# EAGLE design eagle_mini (EAGLE 7.2.0)
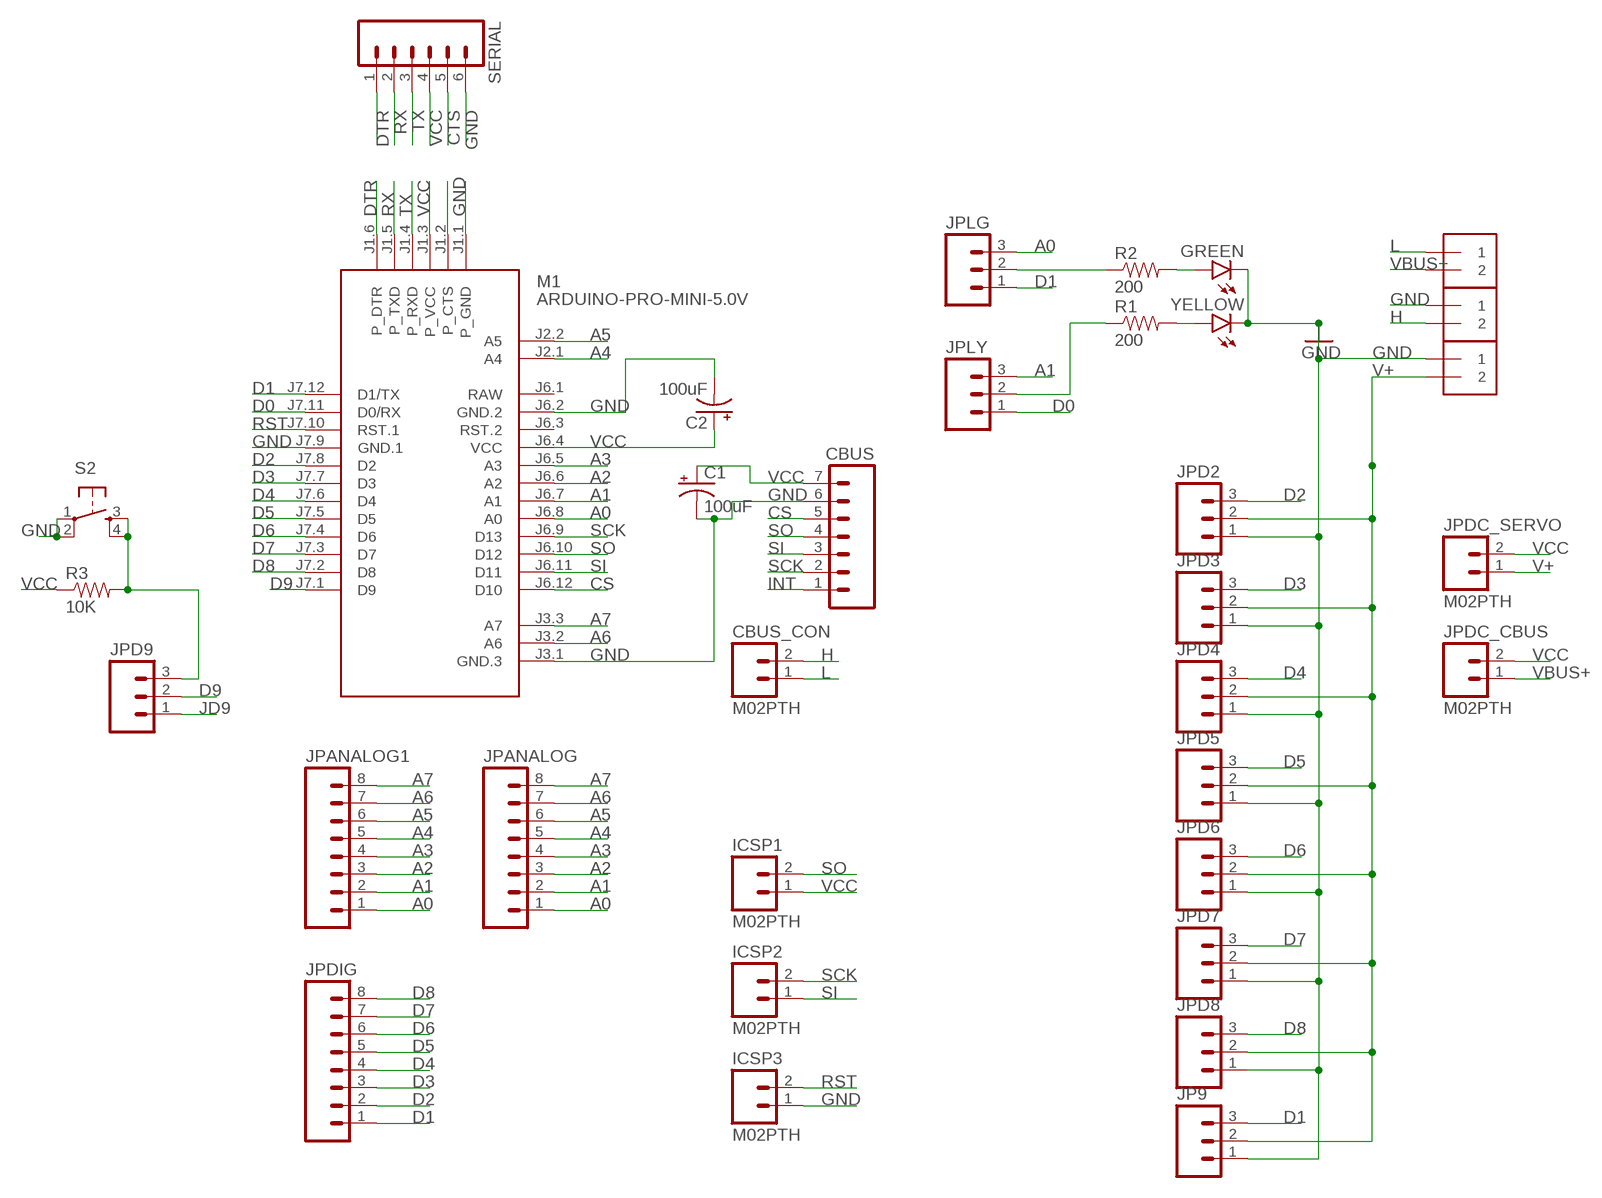
[diagram p0: schematic, sheet 1]

## Parts
C1  100uF  CPOL-USE2.5-6  [E2,5-6]
C2  100uF  CPOL-USE2.5-6  [E2,5-6]
CBUS  M07  [1X07]
CBUS_CON  M02PTH  [1X02]
EXT_VCC  1X2-3.5MM  [1X2-3.5MM]
GREEN  LED-3MM-NO_SILK  [LED3MM-NS]
ICSP1  M02PTH  [1X02]
ICSP2  M02PTH  [1X02]
ICSP3  M02PTH  [1X02]
J1  1X2-3.5MM  [1X2-3.5MM]
J2  1X2-3.5MM  [1X2-3.5MM]
JP9  M03PTH  [1X03]
JPANALOG  M08  [1X08_ROUND]
JPANALOG1  M08  [1X08_ROUND]
JPD2  M03PTH  [1X03]
JPD3  M03PTH  [1X03]
JPD4  M03PTH  [1X03]
JPD5  M03PTH  [1X03]
JPD6  M03PTH  [1X03]
JPD7  M03PTH  [1X03]
JPD8  M03PTH  [1X03]
JPD9  M03PTH  [1X03]
JPDC_CBUS  M02PTH  [1X02]
JPDC_SERVO  M02PTH  [1X02]
JPDIG  M08  [1X08_ROUND]
JPLG  M03PTH  [1X03]
JPLY  M03PTH  [1X03]
M1  ARDUINO-PRO-MINI-5.0V  [ARDUINO-PRO-MINI]
R1  200  RESISTORAXIAL-0.3  [AXIAL-0.3]
R2  200  RESISTORAXIAL-0.3  [AXIAL-0.3]
R3  10K  RESISTORAXIAL-0.3  [AXIAL-0.3]
S2  TAC_SWITCHPTH  [TACTILE-PTH]
SERIAL  M06SILK_FEMALE_PTH  [1X06]
YELLOW  LED-3MM-NO_SILK  [LED3MM-NS]

## Nets
A0: JPANALOG1.1 JPANALOG.1 JPLG.3 M1.J6.8(A0)
A1: JPANALOG1.2 JPANALOG.2 JPLY.3 M1.J6.7(A1)
A2: JPANALOG1.3 JPANALOG.3 M1.J6.6(A2)
A3: JPANALOG1.4 JPANALOG.4 M1.J6.5(A3)
A4: JPANALOG1.5 JPANALOG.5 M1.J2.1(A4)
A5: JPANALOG1.6 JPANALOG.6 M1.J2.2(A5)
A6: JPANALOG1.7 JPANALOG.7 M1.J3.2(A6)
A7: JPANALOG1.8 JPANALOG.8 M1.J3.3(A7)
CS: CBUS.5 M1.J6.12(D10)
CTS: SERIAL.5
D0: JPLY.1 M1.J7.11(D0/RX)
D1: JP9.3 JPDIG.1 JPLG.1 M1.J7.12(D1/TX)
D2: JPD2.3 JPDIG.2 M1.J7.8(D2)
D3: JPD3.3 JPDIG.3 M1.J7.7(D3)
D4: JPD4.3 JPDIG.4 M1.J7.6(D4)
D5: JPD5.3 JPDIG.5 M1.J7.5(D5)
D6: JPD6.3 JPDIG.6 M1.J7.4(D6)
D7: JPD7.3 JPDIG.7 M1.J7.3(D7)
D8: JPD8.3 JPDIG.8 M1.J7.2(D8)
D9: JPD9.2 M1.J7.1(D9)
DTR: M1.J1.6(P_DTR) SERIAL.1
GND: C1.- C2.- CBUS.6 EXT_VCC.1 GREEN.K(C) ICSP3.1 J1.1 JP9.1 JPD2.1 JPD3.1 JPD4.1 JPD5.1 JPD6.1 JPD7.1 JPD8.1 M1.J1.1(P_GND) M1.J3.1(GND.3) M1.J6.2(GND.2) M1.J7.9(GND.1) S2.1 S2.2 SERIAL.6 YELLOW.K(C)
H: CBUS_CON.2 J1.2
INT: CBUS.1
JD9: JPD9.1
L: CBUS_CON.1 J2.1
N$2: JPD9.3 R3.P$2 S2.3 S2.4
N$6: M1.J1.2(P_CTS)
N$17: GREEN.A R2.P$2
N$18: R1.P$2 YELLOW.A
N$27: JPLG.2 R2.P$1
N$28: JPLY.2 R1.P$1
RST: ICSP3.2 M1.J7.10(RST.1)
RX: M1.J1.5(P_TXD) SERIAL.2
SCK: CBUS.2 ICSP2.2 M1.J6.9(D13)
SI: CBUS.3 ICSP2.1 M1.J6.11(D11)
SO: CBUS.4 ICSP1.2 M1.J6.10(D12)
TX: M1.J1.4(P_RXD) SERIAL.3
V+: EXT_VCC.2 JP9.2 JPD2.2 JPD3.2 JPD4.2 JPD5.2 JPD6.2 JPD7.2 JPD8.2 JPDC_SERVO.1
VBUS+: J2.2 JPDC_CBUS.1
VCC: C1.+ C2.+ CBUS.7 ICSP1.1 JPDC_CBUS.2 JPDC_SERVO.2 M1.J1.3(P_VCC) M1.J6.4(VCC) R3.P$1 SERIAL.4
Unconnected: M1.J6.3(RST.2)

## Power pins joined to a net without a drawn wire
RAW: M1.J6.1(RAW)

## Library data of the parts
C1 C2 = adafruit:CPOL-US: POLARIZED CAPACITOR, American symbol
CBUS = SparkFun-Connectors:M07: Header 7 Standard 7-pin 0.1" header. Use with straight break away headers (SKU : PRT-00116), right angle break away headers (PRT-00553), swiss pins (PRT-00743), machine pins (PRT-00117), and female headers (PRT-00115). NOTES ON THE VARIANTS LOCK and LOCK_LONGPADS... This footprint was designed to help hold the alignment of a through-hole component (i.e. 7-pin header) while soldering it into place. You may notice that each hole has been shifted either up or down by 0.005 of an inch from it's more standard position (which is usually a perfectly straight line). This slight alteration caused the pins (the squares in the middle) to touch the edges of the holes. Because they are alternating, it causes a "brace" to hold the header in place. 0.005 has proven to be the perfect amount of "off-center" position when using our standard breakaway headers. Although looks a little odd when you look at the bare footprint, once you have a header in there, the alteration is very hard to notice. Also, if you push a header all the way into place, it is covered up entirely on the bottom side. This idea of altering the position of holes to aid alignment will be further integrated into the Sparkfun Library for other footprints. It can help hold any component with 3 or more connection pins.
CBUS_CON ICSP1-ICSP3 JPDC_CBUS JPDC_SERVO = SparkFun-Connectors:M02: Standard 2-pin 0.1" header. Use with - straight break away headers ( PRT-00116) - right angle break away headers (PRT-00553) - swiss pins (PRT-00743) - machine pins (PRT-00117) - female headers (PRT-00115) Molex polarized connector foot print use with: PRT-08233 with associated crimp pins and housings. 2.54_SCREWTERM for use with PRT-10571. 3.5mm Screw Terminal footprints for PRT-08084 5mm Screw Terminal footprints for use with PRT-08432
EXT_VCC J1 J2 = Arduino_merg:1X2: 3.5mm Terminal block http://www.ladyada.net/library/pcb/eaglelibrary.html
GREEN YELLOW = SparkFun-LED:LED: LEDs Standard schematic elements and footprints for 5mm, 3mm, 1206, and 0603 sized LEDs. 5mm - Spark Fun Electronics SKU : COM-00529 (and others)
JP9 JPD2-JPD9 JPLG JPLY = SparkFun-Connectors:M03: Header 3 Standard 3-pin 0.1" header. Use with straight break away headers (SKU : PRT-00116), right angle break away headers (PRT-00553), swiss pins (PRT-00743), machine pins (PRT-00117), and female headers (PRT-00115). Molex polarized connector foot print use with SKU : PRT-08232 with associated crimp pins and housings.
JPANALOG JPANALOG1 JPDIG = SparkFun-Connectors:M08: Header 8 Standard 8-pin 0.1" header. Use with straight break away headers (SKU : PRT-00116), right angle break away headers (PRT-00553), swiss pins (PRT-00743), machine pins (PRT-00117), and female headers (PRT-00115).
M1 = diy-modules:ARDUINO-PRO-MINI-*: Arduino Pro Mini
R1-R3 = SparkFun-Passives:RESISTOR: Resistor Basic schematic elements and footprints for 0603, 1206, and PTH resistors.
S2 = SparkFun-Retired:TAC_SWITCH: Momentary Switch Button commonly used for reset or general input. Spark Fun Electronics SKU : COM-00097 SMT- SWCH-08247
SERIAL = SparkFun-Connectors:M06: Header 6 Standard 6-pin 0.1" header. Use with straight break away headers (SKU : PRT-00116), right angle break away headers (PRT-00553), swiss pins (PRT-00743), machine pins (PRT-00117), and female headers (PRT-00115). Molex polarized connector foot print use with SKU : PRT-08094 with associated crimp pins and housings. NOTES ON THE VARIANTS LOCK and LOCK_LONGPADS... This footprint was designed to help hold the alignment of a through-hole component (i.e. 6-pin header) while soldering it into place. You may notice that each hole has been shifted either up or down by 0.005 of an inch from it's more standard position (which is a perfectly straight line). This slight alteration caused the pins (the squares in the middle) to touch the edges of the holes. Because they are alternating, it causes a "brace" to hold the component in place. 0.005 has proven to be the perfect amount of "off-center" position when using our standard breakaway headers. Although looks a little odd when you look at the bare footprint, once you have a header in there, the alteration is very hard to notice. Also,if you push a header all the way into place, it is covered up entirely on the bottom side. This idea of altering the position of holes to aid alignment will be further integrated into the Sparkfun Library for other footprints. It can help hold any component with 3 or more connection pins.; PROD_ID: CONN-08437

## Board
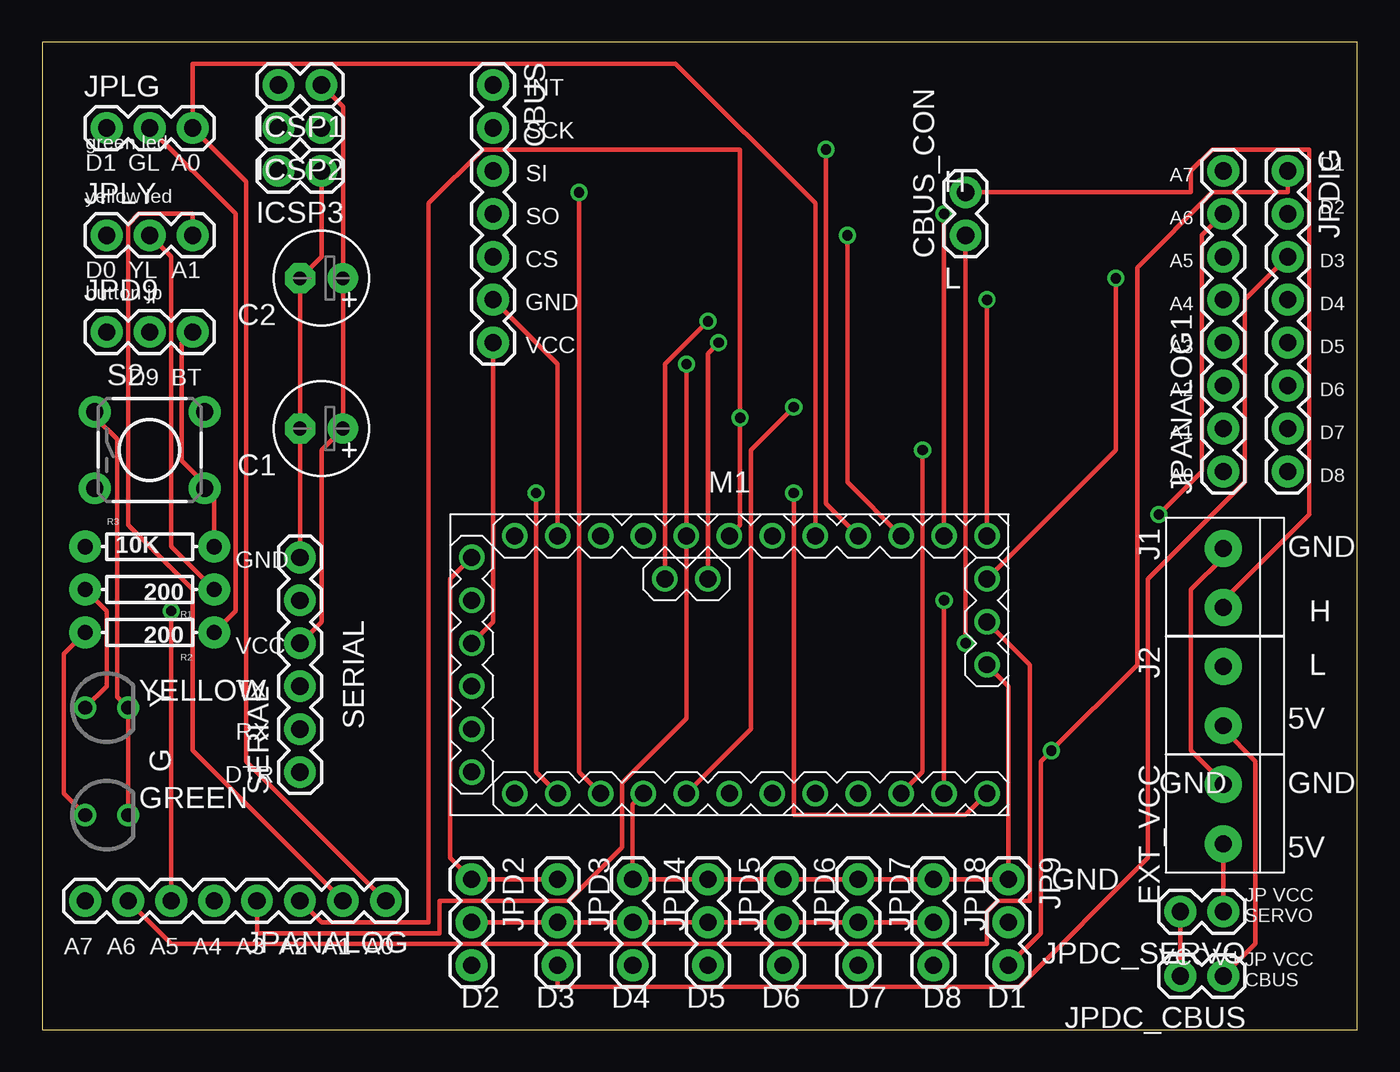
[diagram p1: board, top side]
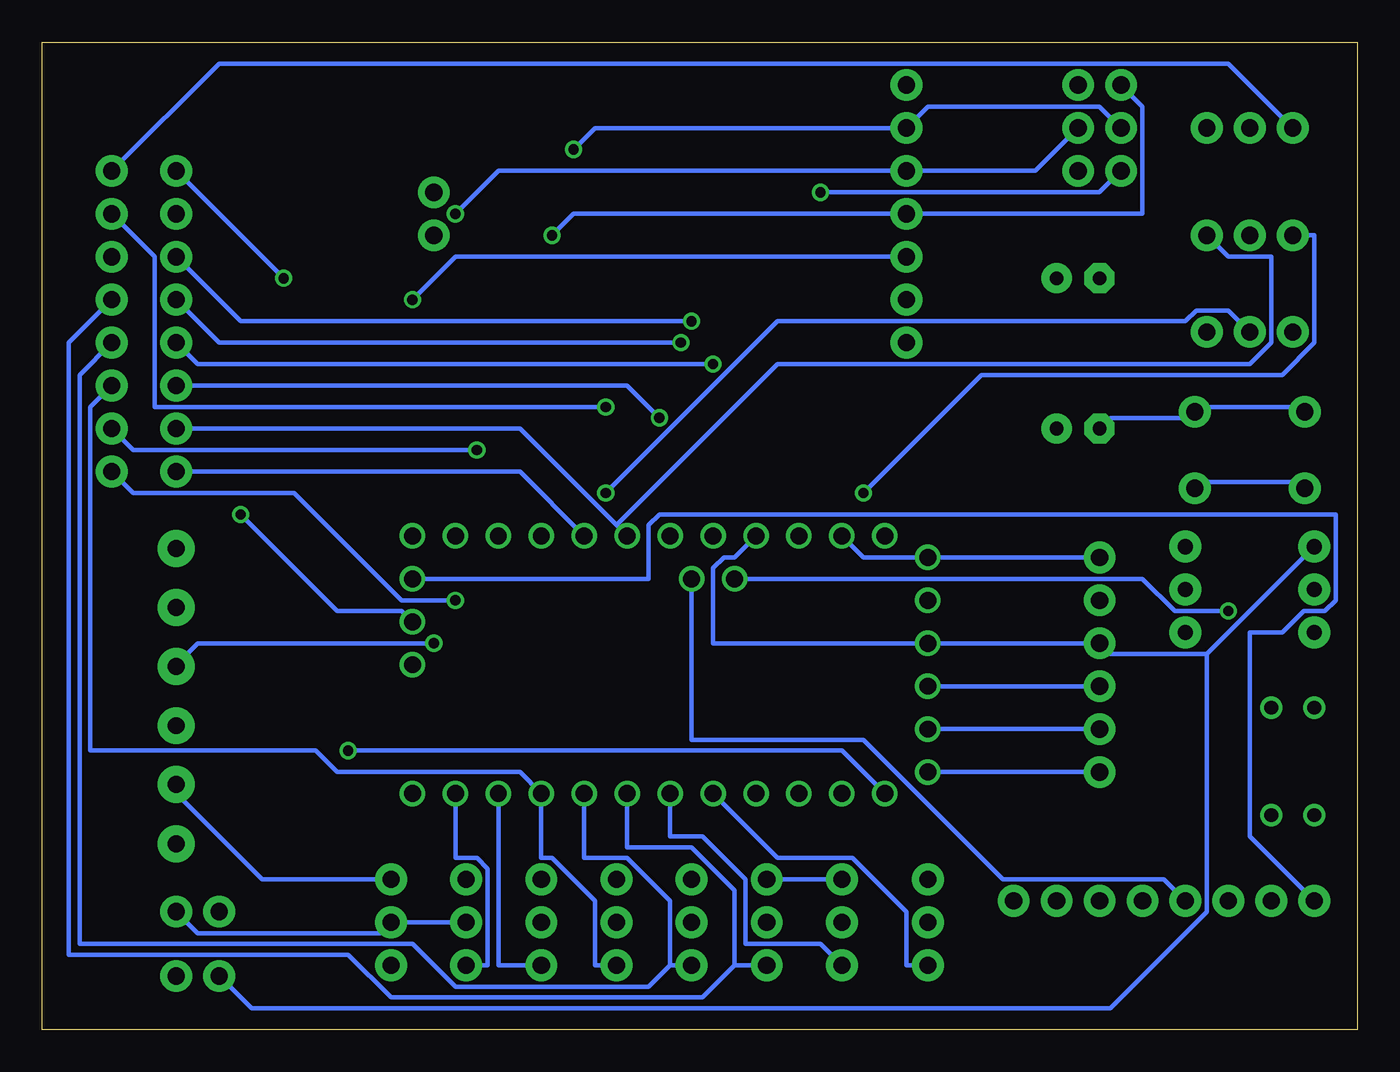
[diagram p2: board, bottom side, seen from below]

Size 77.78 x 58.41 mm. Coordinates in mm from the lower left corner, seen from the top.
Outline: 0,0 77.78,0 77.78,58.41 0,58.41 0,0
Copper layers (1*16): Top 0.035mm / dielectric 1.5mm / Bottom 0.035mm
Design rules "default": minimum track width 10mil, minimum drill 24mil, track to track 8mil, track to pad 8mil, pad to pad 8mil, via to via 8mil, smd to smd 8mil, copper to edge 40mil, drill to drill 8mil, minimum pad ring 10mil, minimum via ring 8mil, stop-mask expansion 4mil, vias tented up to drill 0mil, thermal gap 10mil

### Footprints (pad centres in the part's own frame; a part is rotated, then mirrored left to right if it is on the bottom)
E2,5-6 = drill 0.813 pad 1.778: + -1.27,0 | drill 0.813 pad 1.778 octagon: - 1.27,0
1X07 = drill 1.016 pad 1.88: 1 0,0; 2 2.54,0; 3 5.08,0; 4 7.62,0; 5 10.16,0; 6 12.7,0; 7 15.24,0
1X02 = drill 1.016 pad 1.88: 1 0,0; 2 2.54,0
1X2-3.5MM = drill 1 pad 2.184: 1 1.8,0; 2 -1.7,0
LED3MM-NS = drill 0.813: A -1.27,0; K 1.27,0
1X03 = drill 1.016 pad 1.88: 1 0,0; 2 2.54,0; 3 5.08,0
1X08_ROUND = drill 1.016 pad 1.88: 1 0,0; 2 2.54,0; 3 5.08,0; 4 7.62,0; 5 10.16,0; 6 12.7,0; 7 15.24,0; 8 17.78,0
ARDUINO-PRO-MINI = drill 1: J1.1 -15.24,6.35; J1.2 -15.24,3.81; J1.3 -15.24,1.27; J1.4 -15.24,-1.27; J1.5 -15.24,-3.81; J1.6 -15.24,-6.35; J2.1 -1.27,5.08; J2.2 -3.81,5.08; J3.1 15.24,0; J3.2 15.24,2.54; J3.3 15.24,5.08; J6.1 -12.7,7.62; J6.2 -10.16,7.62; J6.3 -7.62,7.62; J6.4 -5.08,7.62; J6.5 -2.54,7.62; J6.6 0,7.62; J6.7 2.54,7.62; J6.8 5.08,7.62; J6.9 7.62,7.62; J6.10 10.16,7.62; J6.11 12.7,7.62; J6.12 15.24,7.62; J7.1 15.24,-7.62; J7.2 12.7,-7.62; J7.3 10.16,-7.62; J7.4 7.62,-7.62; J7.5 5.08,-7.62; J7.6 2.54,-7.62; J7.7 0,-7.62; J7.8 -2.54,-7.62; J7.9 -5.08,-7.62; J7.10 -7.62,-7.62; J7.11 -10.16,-7.62; J7.12 -12.7,-7.62
AXIAL-0.3 = drill 0.9 pad 1.88: P$1 -3.81,0; P$2 3.81,0
TACTILE-PTH = drill 1.016 pad 1.88: 1 -3.251,2.261; 2 3.251,2.261; 3 -3.251,-2.261; 4 3.251,-2.261
1X06 = drill 1.016 pad 1.88: 1 0,0; 2 2.54,0; 3 5.08,0; 4 7.62,0; 5 10.16,0; 6 12.7,0

### Placement (x,y rotation side)
C1  16.51,35.56 180 top
C2  16.51,44.45 180 top
CBUS  26.67,55.88 270 top
CBUS_CON  54.61,46.99 90 top
EXT_VCC  69.85,12.7 90 top
GREEN  3.81,12.7 0 top
ICSP1  16.51,55.88 180 top
ICSP2  16.51,53.34 180 top
ICSP3  16.51,50.8 180 top
J1  69.85,26.67 90 top
J2  69.85,19.68 90 top
JP9  57.15,8.89 270 top
JPANALOG  20.32,7.62 180 top
JPANALOG1  69.85,33.02 90 top
JPD2  25.4,8.89 270 top
JPD3  30.48,8.89 270 top
JPD4  34.92,8.89 270 top
JPD5  39.37,8.89 270 top
JPD6  43.81,8.89 270 top
JPD7  48.26,8.89 270 top
JPD8  52.7,8.89 270 top
JPD9  3.81,41.27 0 top
JPDC_CBUS  69.85,3.17 180 top
JPDC_SERVO  69.85,6.99 180 top
JPDIG  73.66,50.8 270 top
JPLG  3.81,53.34 0 top
JPLY  3.81,46.99 0 top
M1  40.64,21.59 0 top
R1  6.35,26.04 180 top
R2  6.35,23.5 180 top
R3  6.35,28.57 0 top
S2  6.35,34.29 0 top
SERIAL  15.24,15.24 90 top
YELLOW  3.81,19.05 0 top

### Tracks (layer width: path | path; a pad name or v marks a point on that pad's centre or on a via)
A0
  Top 0.254: JPANALOG.1 12.06,15.88 12.06,50.16 JPLG.3 8.89,57.15 37.47,57.15 45.72,48.9 M1.J6.8
  Bottom 0.254: M1.J6.8 49.53,33.02 JPANALOG1.1
A1
  Top 0.254: JPANALOG.2 8.89,16.51 8.89,26.04 5.08,29.84 5.08,47.62 5.71,48.26 8.89,48.26 JPLY.3
  Bottom 0.254: 43.81,29.84 49.53,35.56 JPANALOG1.2 | 43.81,29.84 M1.J6.7 | 43.81,29.84 34.29,39.37 6.35,39.37 5.08,40.64 5.08,45.72 7.62,45.72 JPLY.3
A2  (via drill 0.61)
  Top 0.254: M1.J6.6 41.27,29.84 v41.27,36.2 41.27,52.07 26.04,52.07 22.86,48.9 22.86,6.35 16.51,6.35 JPANALOG.3
  Bottom 0.254: v41.27,36.2 43.18,38.1 JPANALOG1.3
A3  (via drill 0.61)
  Top 0.254: JPANALOG.4 12.7,5.71 23.5,5.71 23.5,7.62 31.11,7.62 34.29,10.79 34.29,14.61 38.1,18.41 M1.J6.5 v38.1,39.37
  Bottom 0.254: JPANALOG1.4 68.58,39.37 v38.1,39.37
A4  (via drill 0.61)
  Top 0.254: v40.01,40.64 39.37,40.01 M1.J2.1
  Bottom 0.254: M1.J2.1 39.37,17.14 29.21,17.14 20.95,8.89 11.43,8.89 JPANALOG.5 | JPANALOG1.5 67.31,40.64 v40.01,40.64
A5  (via drill 0.61)
  Top 0.254: JPANALOG.6 v7.62,24.77 | v39.37,41.91 36.83,39.37 M1.J2.2
  Bottom 0.254: M1.J2.2 12.7,26.67 10.79,24.77 v7.62,24.77 | JPANALOG1.6 66.04,41.91 v39.37,41.91
A6  (via drill 0.61)
  Top 0.254: v66.04,30.48 68.58,33.02 68.58,46.99 JPANALOG1.7 | JPANALOG.7 7.62,5.08 55.88,5.08 55.88,6.99 56.52,7.62 58.42,7.62 58.42,21.59 M1.J3.2
  Bottom 0.254: M1.J3.2 56.52,24.77 60.33,24.77 v66.04,30.48
A7  (via drill 0.61)
  Top 0.254: M1.J3.3 63.5,34.29 v63.5,44.45
  Bottom 0.254: JPANALOG1.8 v63.5,44.45 | JPANALOG.8 6.35,11.43 6.35,23.5 4.45,23.5 3.17,24.77 1.91,24.77 1.27,25.4 1.27,30.48 41.27,30.48 41.91,29.84 41.91,26.67 M1.J3.3
CS  (via drill 0.61)
  Top 0.254: v55.88,43.18 M1.J6.12
  Bottom 0.254: v55.88,43.18 53.34,45.72 CBUS.5
D0  (via drill 0.61)
  Top 0.254: M1.J7.11 29.21,15.24 v29.21,31.75
  Bottom 0.254: v29.21,31.75 22.23,38.73 4.45,38.73 2.54,40.64 2.54,46.99 JPLY.1
D1  (via drill 0.61)
  Top 0.254: JP9.3 59.05,5.71 59.05,15.88 v59.69,16.51 64.77,21.59 64.77,45.09 69.22,49.53 73.66,49.53 JPDIG.1
  Bottom 0.254: M1.J7.12 30.48,16.51 v59.69,16.51 | JPLG.1 7.62,57.15 67.31,57.15 JPDIG.1
D2  (via drill 0.61)
  Top 0.254: v44.45,36.83 41.91,34.29 41.91,17.78 M1.J7.8
  Bottom 0.254: M1.J7.8 34.29,10.16 29.84,10.16 26.67,6.99 26.67,3.81 JPD2.3 | JPDIG.2 71.12,45.72 71.12,36.83 v44.45,36.83
D3
  Top 0.254: JPDIG.3 71.12,43.18 71.12,32.38 65.41,26.67 65.41,10.16 57.78,2.54 30.48,2.54 JPD3.3
  Bottom 0.254: M1.J7.7 40.64,11.43 38.73,11.43 36.2,8.89 36.2,5.08 31.75,5.08 JPD3.3
D4
  Bottom 0.254: M1.J7.6 43.18,10.79 39.37,10.79 36.83,8.26 36.83,3.81 | JPD4.3 36.83,3.81 | JPDIG.4 76.2,40.64 76.2,4.45 59.69,4.45 57.15,1.91 38.73,1.91 36.83,3.81
D5
  Bottom 0.254: M1.J7.5 45.72,10.16 43.18,10.16 40.64,7.62 40.64,3.81 | JPD5.3 40.64,3.81 | JPDIG.5 75.56,38.73 75.56,5.08 55.88,5.08 53.34,2.54 41.91,2.54 40.64,3.81
D6
  Bottom 0.254: JPD6.3 45.09,3.81 45.09,7.62 47.62,10.16 48.26,10.16 M1.J7.4 49.53,15.24 60.33,15.24 61.59,16.51 74.93,16.51 74.93,36.83 JPDIG.6
D7  (via drill 0.61)
  Top 0.254: v52.07,34.29 52.07,15.24 M1.J7.3
  Bottom 0.254: M1.J7.3 50.8,3.81 JPD7.3 | JPDIG.7 72.39,34.29 v52.07,34.29
D8  (via drill 0.61)
  Top 0.254: M1.J7.2 v53.34,25.4
  Bottom 0.254: M1.J7.2 53.34,10.16 52.07,10.16 51.44,9.53 51.44,3.81 JPD8.3 | JPDIG.8 72.39,31.75 62.87,31.75 56.52,25.4 v53.34,25.4
D9  (via drill 0.61)
  Top 0.254: M1.J7.1 54.61,12.7 44.45,12.7 v44.45,31.75
  Bottom 0.254: v44.45,31.75 34.29,41.91 10.16,41.91 9.53,42.55 7.62,42.55 JPD9.2
DTR
  Bottom 0.254: SERIAL.1 M1.J1.6
GND
  Top 0.254: CBUS.6 30.48,39.37 M1.J6.2 | ICSP3.1 16.51,45.72 C2.- C1.- SERIAL.6 | GREEN.K YELLOW.K 4.45,19.68 4.45,34.92 3.17,36.2 S2.1 | JPD3.1 JPD2.1 24.13,10.16 24.13,26.67 M1.J1.1 | M1.J7.9 34.92,13.34 JPD4.1 JPD5.1 JPD6.1 JPD7.1 JPD8.1 JP9.1 57.15,20.32 M1.J3.1 | J1.1 69.85,27.94 67.94,26.04 67.94,16.51 69.85,14.61 EXT_VCC.1
  Bottom 0.254: SERIAL.6 M1.J1.1 29.21,27.94 M1.J6.2 | C1.- 14.61,36.2 10.16,36.2 S2.2 9.53,36.83 3.17,36.83 S2.1 | JPD4.1 JPD3.1 | JP9.1 64.77,8.89 69.85,13.97 EXT_VCC.1
H
  Top 0.254: CBUS_CON.2 67.94,49.53 67.94,50.8 69.22,52.07 74.93,52.07 74.93,30.48 69.85,25.4 J1.2
L  (via drill 0.61)
  Top 0.254: v54.61,22.86 CBUS_CON.1
  Bottom 0.254: v54.61,22.86 68.58,22.86 69.85,21.59 J2.1
N$2
  Top 0.254: R3.P$2 10.16,31.75 S2.4 9.53,32.38 8.26,33.66 8.26,40.64 JPD9.3
  Bottom 0.254: S2.3 3.17,32.38 9.53,32.38 S2.4
N$17
  Top 0.254: GREEN.A 1.27,13.97 1.27,22.23 R2.P$2
N$18
  Top 0.254: YELLOW.A 3.81,20.32 3.81,24.77 R1.P$2
N$27
  Top 0.254: R2.P$1 11.43,24.77 11.43,48.26 JPLG.2
N$28
  Top 0.254: R1.P$1 7.62,28.57 7.62,45.72 JPLY.2
RST  (via drill 0.61)
  Top 0.254: M1.J7.10 31.75,15.24 v31.75,49.53
  Bottom 0.254: v31.75,49.53 15.24,49.53 ICSP3.2
RX
  Bottom 0.254: SERIAL.2 M1.J1.5
SCK  (via drill 0.61)
  Top 0.254: M1.J6.9 46.35,31.11 v46.35,52.07
  Bottom 0.254: v46.35,52.07 45.09,53.34 CBUS.2 25.4,54.61 15.24,54.61 ICSP2.2
SI  (via drill 0.61)
  Top 0.254: v53.34,48.26 M1.J6.11
  Bottom 0.254: v53.34,48.26 50.8,50.8 CBUS.3 19.05,50.8 ICSP2.1
SO  (via drill 0.61)
  Top 0.254: M1.J6.10 47.62,32.38 v47.62,46.99
  Bottom 0.254: v47.62,46.99 46.35,48.26 CBUS.4 12.7,48.26 12.7,54.61 ICSP1.2
TX
  Bottom 0.254: SERIAL.3 M1.J1.4
V+
  Top 0.254: EXT_VCC.2 JPDC_SERVO.1 | JPD2.2 JPD3.2 JPD4.2 JPD5.2 JPD6.2 JPD7.2 JPD8.2
  Bottom 0.254: JPD8.2 JP9.2 57.78,5.71 68.58,5.71 JPDC_SERVO.1
VBUS+
  Top 0.254: JPDC_CBUS.1 71.75,5.08 71.75,15.88 69.85,17.78 J2.2
VCC
  Top 0.254: ICSP1.1 17.78,54.61 C2.+ C1.+ 16.51,34.29 16.51,24.13 SERIAL.4 | JPDC_SERVO.2 JPDC_CBUS.2 | CBUS.7 26.67,24.13 M1.J1.3
  Bottom 0.254: M1.J6.4 36.83,27.94 37.47,27.94 38.1,27.3 38.1,22.86 M1.J1.3 SERIAL.4 14.61,22.23 8.89,22.23 | 8.89,22.23 R3.P$1 | JPDC_CBUS.2 65.41,1.27 14.61,1.27 8.89,6.99 8.89,22.23

### Text on the board
_tsilk: INT | SCK | green led | D1 | GL | A0 | D1 | SI | H | A7 | yellow led | SO | A6 | D2 | CS | A5 | D3 | D0 | YL | A1 | L | button jp | GND | A4 | D4 | VCC | A3 | D5 | D9 | BT | A2 | D6 | A1 | D7 | A0 | D8 | GND | GND | H | VCC | L | TX | Y | SERIAL | 5V | RX | G | DTR | GND | GND | 5V | GND | JP VCC / SERVO | A7 | A6 | A5 | A4 | A3 | A2 | A1 | A0 | VCC | V+ | JP VCC / CBUS | D2 | D3 | D4 | D5 | D6 | D7 | D8 | D1